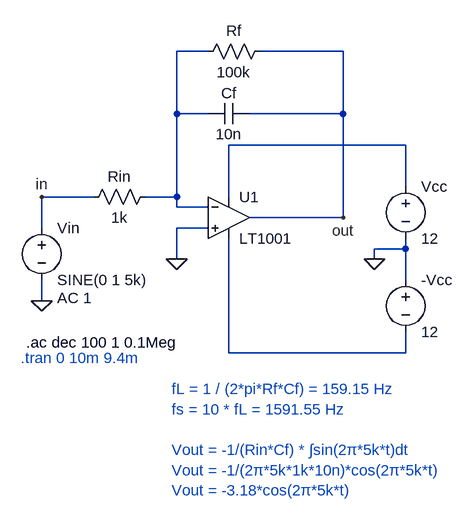
[diagram p0: schematic integrator.asc]
integrator.asc, the LTspice schematic file:
Version 4.1
SHEET 1 880 680
WIRE 176 -80 128 -80
WIRE 384 -80 256 -80
WIRE 128 16 128 -80
WIRE 176 16 128 16
WIRE 384 16 384 -80
WIRE 384 16 240 16
WIRE 480 64 208 64
WIRE 480 128 480 64
WIRE 0 144 -80 144
WIRE 128 144 128 16
WIRE 128 144 80 144
WIRE 208 144 208 64
WIRE 128 160 128 144
WIRE 176 160 128 160
WIRE 384 176 384 16
WIRE 384 176 240 176
WIRE -80 192 -80 144
WIRE 176 192 128 192
WIRE 480 224 480 208
WIRE 480 224 432 224
WIRE 128 240 128 192
WIRE 432 240 432 224
WIRE 480 272 480 224
WIRE -80 304 -80 272
WIRE 208 384 208 208
WIRE 480 384 480 352
WIRE 480 384 208 384
FLAG 128 240 0
FLAG -80 304 0
FLAG 432 240 0
FLAG 384 176 out
FLAG -80 144 in
SYMBOL OpAmps\\LT1001 208 112 R0
SYMATTR InstName U1
SYMBOL res 96 128 R90
WINDOW 0 0 56 VBottom 2
WINDOW 3 32 56 VTop 2
SYMATTR InstName Rin
SYMATTR Value 1k
SYMBOL voltage -80 176 R0
WINDOW 123 24 124 Left 2
WINDOW 39 0 0 Left 0
SYMATTR InstName Vin
SYMATTR Value SINE(0 1 5k)
SYMATTR Value2 AC 1
SYMBOL cap 240 0 R90
WINDOW 0 0 32 VBottom 2
WINDOW 3 32 32 VTop 2
SYMATTR InstName Cf
SYMATTR Value 10n
SYMBOL res 272 -96 R90
WINDOW 0 0 56 VBottom 2
WINDOW 3 32 56 VTop 2
SYMATTR InstName Rf
SYMATTR Value 100k
SYMBOL voltage 480 112 R0
WINDOW 123 0 0 Left 0
WINDOW 39 0 0 Left 0
SYMATTR InstName Vcc
SYMATTR Value 12
SYMBOL voltage 480 256 R0
WINDOW 123 0 0 Left 0
WINDOW 39 0 0 Left 0
SYMATTR InstName -Vcc
SYMATTR Value 12
TEXT -112 392 Left 2 ;.tran 0 10m 9.4m
TEXT 120 440 Left 2 ;fL = 1 / (2*pi*Rf*Cf) = 159.15 Hz\nfs = 10 * fL = 1591.55 Hz\n \nVout = -1/(Rin*Cf) * ∫sin(2π*5k*t)dt\nVout = -1/(2π*5k*1k*10n)*cos(2π*5k*t)\nVout = -3.18*cos(2π*5k*t)
TEXT -104 368 Left 2 !.ac dec 100 1 0.1Meg

The netlist it stands for:
* integrator.asc
X§U1 0 N001 N002 N003 out LT1001  ; pins In+ In- V+ V- OUT
Rin N001 in 1k
Vin in 0 SINE(0 1 5k) AC 1
Cf out N001 10n
Rf out N001 100k
Vcc N002 0 12
V§-Vcc 0 N003 12
* .tran 0 10m 9.4m
* fL = 1 / (2*pi*Rf*Cf) = 159.15 Hz
* fs = 10 * fL = 1591.55 Hz
* Vout = -1/(Rin*Cf) * ∫sin(2π*5k*t)dt
* Vout = -1/(2π*5k*1k*10n)*cos(2π*5k*t)
* Vout = -3.18*cos(2π*5k*t)
.ac dec 100 1 0.1Meg
.lib LTC.lib
.backanno
.end